# EasyEDA Pro project ProPrj_iamge v2_2026-08-18.epro, board PCB5
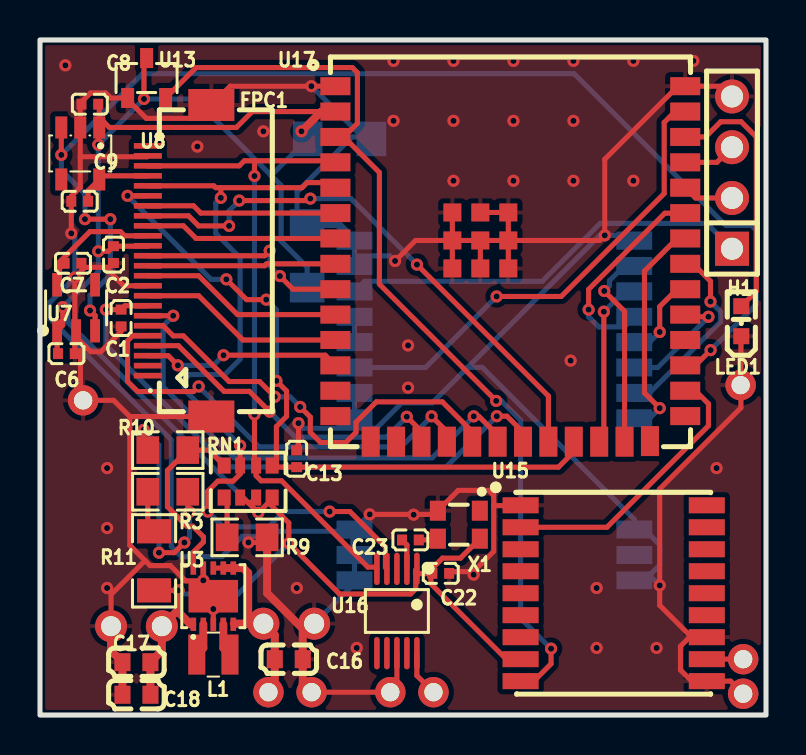
[diagram p4: board, top side]
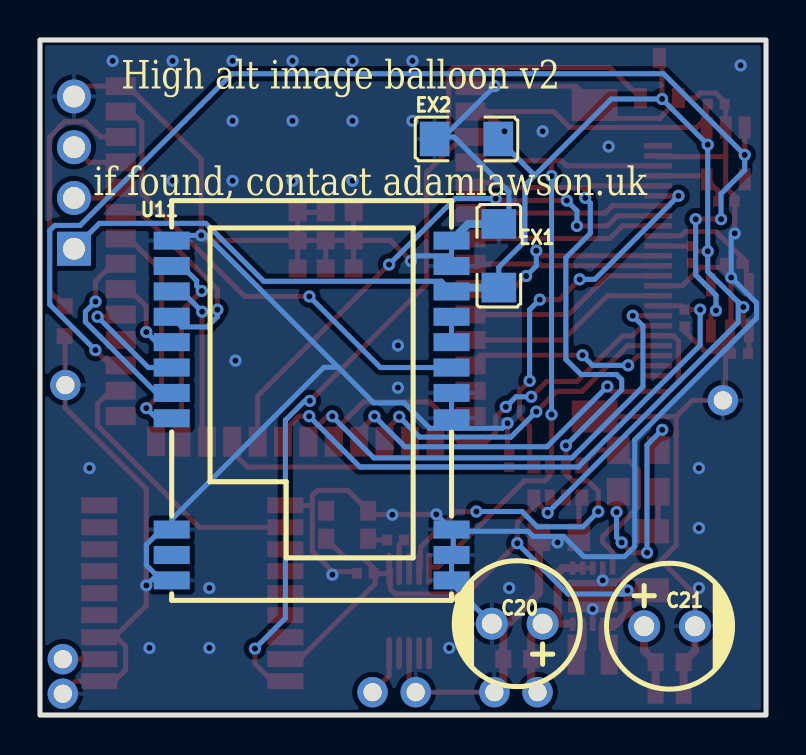
[diagram p5: board, bottom side, seen from below]

Outline 36.32 x 33.78 mm; copper layers: Top Layer, Bottom Layer. Coordinates in mm from the lower left corner of the outline.
Outline path: rectangle 0,33.78 36.32,0
Stack: Top Layer 0.035mm / Dielectric1 1.51mm FR4 er 4.5 / Bottom Layer 0.035mm

## Design rules (mm)
template: JLCPCB Capability(Two Layers Board)
spacing copperThickness1oz (default): track to track 0.102, other pairs 0.152 to 0.3
spacing copperThickness2oz: track to track 0.203, other pairs 0.152 to 0.3
track width copperThickness1oz (default): min 0.127, default 0.254, max 2.54
track width copperThickness2oz: min 0.203, default 0.254, max 2.54
differential pair differentialPair (default): width min 0.127, default 0.254, max 2.54; gap min 0.152, default 0.152
via viaSize (default): diameter min 0.5, default 0.61, max 10; hole min 0.3, default 0.305, max 6.3

## Placement (name value [footprint] x y rotation side)
C1  15pF  [C0402]  4.06 19.87 90 top
C2  100nF  [C0402]  3.68 23.04 90 top
C6  1uF  [C0402]  1.32 18.08 180 top
C7  1uF  [C0402]  1.65 22.61 180 top
C8  1uF  [C0402]  2.49 30.57 0 top
C9  1uF  [C0402]  1.99 25.71 0 top
C13  100nF  [C0402]  12.84 12.83 90 top
C16  10uF  [C0603]  12.45 2.79 180 top
C17  10uF  [C0603]  4.82 2.65 0 top
C18  10uF  [C0603]  4.83 1.02 0 top
C20  1000uF  [CAP-TH_BD6.3-P2.50-D1.0-FD]  12.45 4.57 0 bottom
C21  1000uF  [CAP-TH_BD6.3-P2.50-D1.0-FD]  4.83 4.44 180 bottom
C22  1uF  [C0402]  20.05 7.09 0 top
C23  100nF  [C0402]  18.53 8.76 180 top
EX1  EX  [C1206]  13.37 22.98 90 bottom
EX2  EX  [C1206]  14.99 28.83 180 bottom
FPC1  FH12-24S-0.5SH(55)  [FPC-SMD_FH12-24S-0.5SH-55]  6.99 22.73 270 top
H1  PZ254V-11-04P  [HDR-TH_4P-P2.54-V-M]  34.62 27.14 90 top
L1  4.7uH  [IND-SMD_L2.5-W2.0-VLS252012CX-150M]  8.67 3.03 180 top
LED1  KT-0603R  [LED-SMD_L1.6-W0.8-R-RD]  35.09 19.71 90 top
NOREF  -  [Pad_e13545]  35.05 16.51 0 top
NOREF#2  -  [Pad_e7784]  11.43 1.14 0 top
NOREF#3  -  [Pad_e7785]  13.59 1.14 0 top
NOREF#4  -  [Pad_e7783]  35.18 1.07 0 top
NOREF#5  -  [Pad_e7778]  19.69 1.14 0 top
NOREF#6  -  [Pad_e13546]  2.16 15.75 0 top
NOREF#7  -  [Pad_e7779]  17.53 1.14 0 top
NOREF#8  -  [Pad_e7782]  35.18 2.79 0 top
R3  16kΩ  [R0805]  6.39 11.17 180 top
R9  82kΩ  [R0805]  10.36 8.89 0 top
R10  470kΩ  [R0805]  6.39 13.26 180 top
R11  1kΩ  [R1206]  5.71 7.72 270 top
RN1  4.7kΩ  [RES-ARRAY-SMD_0603-8P-L3.2-W1.6-BL]  10.41 11.68 180 top
U3  RT6150AGQW  [WDFN-10_L3.0-W3.0-P0.50-BL-EP]  8.67 5.95 0 top
U7  ME6211C12M5G-N  [SOT-23-5_L3.0-W1.7-P0.95-LS2.8-BL]  1.81 20.38 0 top
U8  ME6211C28M5G-N  [SOT-23-5_L3.0-W1.7-P0.95-LS2.8-BR]  2.02 28.1 90 top
U11  E22-900M22S  [WIRELM-SMD_E22-900M22S]  22.73 15.24 180 bottom
U13  MAX809STRG-TP  [SOT-23-3_L2.9-W1.3-P1.90-LS2.4-BR]  5.33 31.88 270 top
U15  ATGM336H-5NR32  [GPS-SMD_18P-L10.1-W9.7-P1.10-TL]  28.7 6.1 0 top
U16  SI5351A-B-GTR  [MSOP-10_L3.0-W3.0-P0.50-LS5.0-BL]  17.86 5.21 180 top
U17  2.4GHz  [WIRELM-SMD_ESP32-S3-WROOM-1U]  23.53 22.57 0 top
X1  26MHz  [OSC-SMD_4P-L2.5-W2.0-BL_X1G0042110003]  20.96 9.52 180 top

## Footprints (pads in the part's own frame, mm; a bottom-side part is the same pattern mirrored in y, then rotated)
C0402
  rect 0.5x0.54 smd: 1(-0.42,0) 2(0.42,0)
C0603
  rect 0.8x0.9 smd: 1(-0.7,0) 2(0.7,0)
C1206
  rect 1.485x1.728 smd: 1(-1.593,0) 2(1.593,0)
CAP-TH_BD6.3-P2.50-D1.0-FD
  round 1.6 hole 1: 1(-1.27,0) 2(1.27,0)
FPC-SMD_FH12-24S-0.5SH-55
  rect 0.28x1.4 smd: 1(5.75,-1.588) 2(5.25,-1.588) 3(4.75,-1.588) 4(4.25,-1.588) 5(3.751,-1.588) 6(3.25,-1.588) 7(2.751,-1.588) 8(2.251,-1.588) 9(1.75,-1.588) 10(1.25,-1.588) 11(0.75,-1.588) 12(0.25,-1.588) 13(-0.25,-1.588) 14(-0.75,-1.588) 15(-1.25,-1.588) 16(-1.75,-1.588) 17(-2.25,-1.588) 18(-2.75,-1.588) 19(-3.25,-1.588) 20(-3.75,-1.588) 21(-4.25,-1.588) 22(-4.75,-1.588) 23(-5.25,-1.588) 24(-5.75,-1.588)
  rect 1.6x2.3 smd: 25(7.795,1.588) 26(-7.795,1.588)
GPS-SMD_18P-L10.1-W9.7-P1.10-TL
  rect 1.8x0.8 smd: 1(-4.657,4.4) 2(-4.657,3.3) 3(-4.657,2.2) 4(-4.657,1.1) 5(-4.657,0) 6(-4.657,-1.1) 7(-4.657,-2.2) 8(-4.657,-3.3) 9(-4.657,-4.4) 10(4.657,-4.4) 11(4.657,-3.3) 12(4.657,-2.2) 13(4.657,-1.1) 14(4.657,0) 15(4.657,1.1) 16(4.657,2.2) 17(4.657,3.3) 18(4.657,4.4)
HDR-TH_4P-P2.54-V-M
  rect 1.7x1.7 hole 1.1: 1(-3.81,0)
  round 1.7 hole 1.1: 2(-1.27,0) 3(1.27,0) 4(3.81,0)
IND-SMD_L2.5-W2.0-VLS252012CX-150M
  rect 0.85x2 smd: 1(-0.83,0) 2(0.83,0)
LED-SMD_L1.6-W0.8-R-RD
  rect 0.8x0.8 smd: 1(0.75,0) 2(-0.75,0)
MSOP-10_L3.0-W3.0-P0.50-LS5.0-BL
  oval 0.28x1.62 smd: 1(-1,-2.11) 2(-0.5,-2.11) 3(0,-2.11) 4(0.5,-2.11) 5(1,-2.11) 6(1,2.11) 7(0.5,2.11) 8(0,2.11) 9(-0.5,2.11) 10(-1,2.11)
OSC-SMD_4P-L2.5-W2.0-BL_X1G0042110003
  rect 0.8x1 smd: 1(-1.05,-0.7) 2(1.05,-0.7) 3(1.05,0.7) 4(-1.05,0.7)
Pad_e7778
  round 1.524 hole 0.914: 1(0,0)
Pad_e7779
  round 1.524 hole 0.914: 2(0,0)
Pad_e7782
  round 1.524 hole 0.914: 1(0,0)
Pad_e7783
  round 1.524 hole 0.914: 1(0,0)
Pad_e7784
  round 1.524 hole 0.914: 2(0,0)
Pad_e7785
  round 1.524 hole 0.914: 2(0,0)
Pad_e13545
  round 1.524 hole 0.914: 1(0,0)
Pad_e13546
  round 1.524 hole 0.914: 1(0,0)
R0805
  rect 1.133x1.377 smd: 1(-1,0) 2(1,0)
R1206
  rect 1.208x1.701 smd: 1(-1.479,0) 2(1.479,0)
RES-ARRAY-SMD_0603-8P-L3.2-W1.6-BL
  rect 0.65x0.8 smd: 1(-1.2,-0.8) 4(1.2,-0.8) 5(1.2,0.8) 8(-1.2,0.8)
  rect 0.5x0.8 smd: 2(-0.4,-0.8) 3(0.4,-0.8) 6(0.4,0.8) 7(-0.4,0.8)
SOT-23-3_L2.9-W1.3-P1.90-LS2.4-BR
  rect 1x0.65 smd: 1(1,-0.95) 2(1,0.95) 3(-1,0)
SOT-23-5_L3.0-W1.7-P0.95-LS2.8-BL
  rect 0.49x1.157 smd: 1(-0.95,-1.153) 2(0,-1.153) 3(0.95,-1.153)
  rect 0.49x1.175 smd: 4(0.95,1.153) 5(-0.95,1.153)
SOT-23-5_L3.0-W1.7-P0.95-LS2.8-BR
  rect 1.1x0.6 smd: 1(1.3,-0.95) 2(1.3,0) 3(1.3,0.95) 4(-1.3,0.95) 5(-1.3,-0.95)
WDFN-10_L3.0-W3.0-P0.50-BL-EP
  rect 0.28x0.665 smd: 1(-1,-1.407) 2(-0.5,-1.407) 3(0,-1.407) 4(0.5,-1.407) 5(1,-1.407) 6(1,1.407) 7(0.5,1.407) 8(0,1.407) 9(-0.5,1.407) 10(-1,1.407)
  rect 2.475x1.625 smd: 11(0,0)
WIRELM-SMD_E22-900M22S
  rect 1.8x0.9 smd: 1(7,-8.5) 2(7,-7.23) 3(7,-5.96) 4(7,-0.39) 5(7,0.88) 6(7,2.15) 7(7,3.42) 8(7,4.69) 9(7,5.96) 10(7,7.23) 11(7,8.5) 12(-7,8.5) 13(-7,7.23) 14(-7,5.96) 15(-7,4.69) 16(-7,3.42) 17(-7,2.15) 18(-7,0.88) 19(-7,-0.39) 20(-7,-5.96) 21(-7,-7.23) 22(-7,-8.5)
WIRELM-SMD_ESP32-S3-WROOM-1U
  rect 1.5x0.9 smd: 1(-8.75,8.895) 2(-8.75,7.625) 3(-8.75,6.355) 4(-8.75,5.085) 5(-8.75,3.815) 6(-8.75,2.545) 7(-8.75,1.275) 8(-8.75,0.005) 9(-8.75,-1.265) 10(-8.75,-2.535) 11(-8.75,-3.805) 12(-8.75,-5.075) 13(-8.75,-6.345) 14(-8.75,-7.615) 27(8.75,-7.615) 28(8.75,-6.345) 29(8.75,-5.075) 30(8.75,-3.805) 31(8.75,-2.535) 32(8.75,-1.265) 33(8.75,0.005) 34(8.75,1.275) 35(8.75,2.545) 36(8.75,3.815) 37(8.75,5.085) 38(8.75,6.355) 39(8.75,7.625) 40(8.75,8.895)
  rect 0.9x1.5 smd: 15(-6.985,-8.895) 16(-5.715,-8.895) 17(-4.445,-8.895) 18(-3.175,-8.895) 19(-1.905,-8.895) 20(-0.635,-8.895) 21(0.635,-8.895) 22(1.905,-8.895) 23(3.175,-8.895) 24(4.445,-8.895) 25(5.715,-8.895) 26(6.985,-8.865)
  rect 0.9x0.9 smd: 41(-2.9,2.575) 41(-2.9,1.175) 41(-2.9,-0.225) 41(-1.5,2.575) 41(-1.5,1.175) 41(-1.5,-0.225) 41(-0.1,2.575) 41(-0.1,1.175) 41(-0.1,-0.225)

## Nets
As in the schematic, except:
GND: C1.1 C2.1 C6.1 C7.1 C8.1 C9.1 C13.2 C16.1 C17.1 C18.1 C20.2 C21.2 C22.2 EX1.2 EX2.1 FPC1.10 FPC1.23 FPC1.25 FPC1.26 H1.4 LED1.2 NOREF.1 NOREF#3.2 NOREF#4.1 NOREF#6.1 NOREF#7.2 R9.2 U3.3 U3.9 U3.11 U7.2 U8.2 U11.1 U11.2 U11.3 U11.4 U11.5 U11.10 U11.11 U11.12 U11.20 U11.22 U13.1 U15.1 U15.10 U15.12 U16.8 U17.1 U17.40 U17.41 X1.2
GPSANT: NOREF#8.1 U15.11
PV: C16.2 C20.1 NOREF#2.2 U3.5 U3.6 U3.7 U3.8
SI5351A: NOREF#5.1 U16.10

Pads without a net: FPC1 1 2 24; U7 4; U8 4; U15 3 4 5 6 7 13 14 15 16 17 18; U16 3 6 7 9; U17 13 14 15 16 26 30; X1 1

## Via types
v1: diameter 0.61, hole 0.305, Top Layer to Bottom Layer, 97 vias

## Routing (per net, layer and track width the routed paths; a pad name or vN(x,y) marks a point on that pad's centre or on a via; arc(x,y) is an arc through that point)
1.2V: length 6.7
  Top Layer w0.254: 5.4,23.98 4.24,23.98 4.03,24.19 2.5,24.19 0.98,22.67 0.98,22.35 ; U7.5 0.98,21.65 0.98,22.35 ; 0.98,22.35 C7.2
2.8V: length 3.8
  Top Layer w0.254: 5.4,26.98 3.15,26.98 U8.5 2.41,26.24 C9.2
3.3V: length 128.9
  Top Layer w0.254: 11.43,10.63 11.61,10.81 RN1.8 ; 11.43,10.63 12.45,9.61 v1(12.45,8.6) 14.99,6.06 18.54,6.06 18.8,6.31 18.8,7.07 ; 11.43,10.63 v1(10.92,10.12) 10.41,10.63 ; 10.41,10.63 10.56,10.63 RN1.7 ; 10.41,10.63 10.16,10.88 RN1.6 ; 18.8,7.07 18.8,7.26 U16.1 ; 18.8,7.07 19.56,7.07 ; 19.56,7.07 19.63,7.09 19.63,7.34 20.14,7.85 21.03,7.85 22,8.83 ; 19.56,7.07 19.56,6.57 23.33,2.8 U15.8 ; v1(2.92,28.54) 2.92,29.35 U8.1 2.97,29.91 ; U13.3 5.2,32.74 v1(5.2,30.83) ; v1(2.92,23.21) 3.42,23.21 C2.2 5.38,23.46 5.4,23.48 ; 2.97,29.91 3.47,29.4 9.82,29.4 10.62,30.2 U17.2 ; 2.97,29.91 2.97,30.52 C8.2 ; 0.9,18.08 0.86,18.13 U7.1 1.14,19.51 v1(1.14,20.41) ; v1(6.93,6.24) R11.2
  Top Layer w0.4: 5.52,1.02 C17.2 6.1,3.22 C21.1 6.87,5.22 6.93,5.22 ; 6.93,5.22 6.93,5.14 7.53,4.54 7.61,4.54 ; 6.93,5.22 v1(6.93,6.24) ; v1(13.08,29.21) 14.07,30.2
  Bottom Layer w0.254: 1.39,20.67 2.92,22.19 v1(2.92,23.21) v1(2.92,28.54) v1(5.2,30.83) 7.74,30.83 11.55,27.02 ; 1.39,20.67 1.39,19.65 v1(10.92,10.12) ; 1.39,20.67 v1(1.14,20.41) ; EX2.2 11.58,27.02 11.55,27.02 ; v1(12.45,8.6) 9.91,6.06 7.11,6.06 v1(6.93,6.24) ; EX1.1 13.37,22.41 12.06,23.72 12.06,26.51 11.55,27.02 ; U11.9 16.24,21.71 25.13,21.71 28.03,24.6 33.35,24.6 H1.1
  Bottom Layer w0.4: EX1.1 15.54,21.39 U11.9
GND: length 245.9
  Top Layer w0.254: 2.28,18.43 2.53,18.18 3.04,18.18 4.06,19.19 C1.1 ; 2.28,18.43 2.03,18.18 ; 2.28,18.43 1.81,18.91 U7.2 ; U17.41 U17.41 ; U17.41 18.79,23.75 v1(17.76,22.72) ; U17.41 U17.41 ; U17.41 U17.41 ; U17.41 U17.41 ; U17.41 U17.41 ; C22.2 20.56,7.18 21.68,7.18 22.7,8.19 22.7,10.48 ; U15.12 33.31,3.95 32.55,3.95 ; 4.49,14.94 FPC1.25 ; 4.49,14.94 3.68,15.75 NOREF#6.1 2.03,15.88 2.03,18.18 ; 4.49,14.94 4.49,8.49 5.26,7.73 ; U15.1 24.03,10.48 22.7,10.48 ; 3.27,22.4 3.46,22.4 C2.1 ; 3.27,22.4 4.19,21.48 5.4,21.48 ; 3.27,22.4 2.25,22.4 ; 32.55,3.95 32.04,3.44 32.04,2.25 32.6,1.7 U15.10 34.55,1.7 NOREF#4.1 ; 32.55,3.95 31,5.49 v1(31,6.49) 31,11.31 35.07,15.38 35.07,16.49 ; v1(10.43,8.64) 11.11,8.64 R9.2 ; LED1.2 35.07,18.94 35.07,16.49 ; 2.03,18.18 1.84,18.18 C6.1 v1(1.74,21.89) 2.25,22.4 ; U17.41 U17.41 ; U17.41 28,23.75 v1(28.26,24) 28.26,27.81 31.81,31.37 32.18,31.37 U17.40 34.11,31.47 H1.4 ; U17.41 U17.41 U17.41 ; 35.07,16.49 NOREF.1 ; 5.4,27.98 5.35,27.94 2.02,27.94 ; 2.25,22.4 C7.1 ; v1(1.57,24.1) C9.1 1.57,25.96 2.02,26.41 2.02,27.94 ; 2.02,30.51 2.02,30.62 2.52,31.13 3.29,31.13 3.54,30.88 4.3,30.88 ; 2.02,30.51 C8.1 ; 2.02,30.51 U8.2 2.02,27.94 ; 5.26,7.73 3.56,6.03 C21.2 ; 5.26,7.73 5.51,7.48 6.53,7.48 7.29,6.72 8.05,6.72 8.05,6.57 U3.11 v1(8.67,5.31) U3.3 ; 4.3,30.88 5.32,29.86 7.91,29.86 FPC1.26 9.51,31.47 v1(13.58,31.47) U17.1 ; 4.3,30.88 U13.1 ; 22.7,10.48 22.7,10.99 22.44,11.24 20.92,11.24 X1.2 19.72,10.04 v1(16.5,10.04) ; U16.8 17.86,1.47 NOREF#7.2 NOREF#3.2 ; v1(8.17,6.74) U3.9 ; v1(12.93,14.6) 12.93,13.33 C13.2
  Top Layer w0.4: NOREF#3.2 13.15,1.59 C16.1 ; 13.14,2.8 13.14,4.32 11.36,6.1 R9.2 ; C21.2 3.56,3.21 C17.1 4.12,1.02
  Bottom Layer w0.254: U11.22 30.24,6.74 30.5,6.99 ; v1(13.58,31.47) 16.12,28.93 ; 16.12,28.93 16.48,28.93 EX2.1 ; 16.12,28.93 15.61,28.93 12.86,26.18 12.86,25.08 EX1.2 ; 21.4,17.4 28,24 v1(28.26,24) 29.47,24 U11.12 ; 21.4,17.4 22.12,17.4 29.73,9.79 U11.20 30.24,9.28 31,8.52 31,7.5 30.5,6.99 ; 21.4,17.4 19.62,15.62 18.1,15.62 16.83,14.35 15.81,14.35 ; 15.73,22.98 U11.10 ; 15.73,22.98 U11.11 ; 15.73,22.98 17.51,22.98 v1(17.76,22.72) ; 30.5,6.99 v1(31,6.49) ; 15.81,14.35 15.81,14.77 U11.4 U11.5 ; 15.81,14.35 13.19,14.35 v1(12.93,14.6) ; 15.65,9.19 15.65,8.09 U11.2 U11.1 15.73,6.59 C20.2 ; 15.65,9.19 11.9,9.19 11.65,8.94 10.12,8.94 ; 15.65,9.19 U11.3 v1(16.5,10.04) ; v1(1.57,24.1) 1.74,23.93 v1(1.74,21.89) 0.47,20.62 0.47,19.86 6.57,13.77 6.57,8.43 7.08,7.92 9.11,7.92 10.12,8.94 ; 10.12,8.94 v1(10.43,8.64)
  Bottom Layer w0.4: EX1.2 14.9,24.58 U11.11
  vias: v1(1.27,32.51) v1(3.36,12.36) v1(3.36,9.36) v1(3.36,6.36) v1(7.87,28.45) v1(11.18,29.21) v1(12.85,6.36) v1(15.85,3.36) v1(17.69,32.74) v1(17.69,29.74) v1(18.41,18.49) v1(18.41,16.38) v1(18.69,10.02) v1(20.69,32.74) v1(20.69,29.74) v1(20.69,26.74) v1(21.69,7.02) v1(23.69,32.74) v1(23.69,29.74) v1(23.69,26.74) v1(26.55,17.74) v1(26.69,32.74) v1(26.69,29.74) v1(26.69,26.74) v1(27.85,6.36) v1(27.85,3.36) v1(29.69,32.74) v1(29.69,26.74) v1(30.85,3.36) v1(32.69,32.74) v1(33.85,12.36)
BUSY: length 8.5
  Top Layer w0.254: U17.24 28.21,13.91 v1(28.21,20.18)
  Bottom Layer w0.254: v1(28.21,20.18) 29.22,21.2 U11.14
CAMPWR: length 60.7
  Top Layer w0.254: U7.3 2.76,19.99 v1(2.5,20.24) ; v1(3.52,24.81) v1(2.25,24.81) ; v1(1.07,28.03) U8.3 ; v1(33.55,18.26) 32.79,17.5 U17.29
  Bottom Layer w0.254: v1(33.55,18.26) 35.84,20.55 35.84,24.25 35.58,24.5 34.31,24.5 26.72,32.09 5.13,32.09 v1(1.07,28.03) 1.07,27.27 2.25,26.08 v1(2.25,24.81) ; v1(2.5,20.24) 2.5,21 3.52,22.02 v1(3.52,24.81)
CAMRST: length 35.1
  Top Layer w0.254: 11.83,12.41 11.83,14.44 12.34,14.95 12.34,16.22 v1(11.83,16.72) ; 11.83,12.41 C13.1 25.94,12.41 26.7,13.17 U17.23 ; 11.83,12.41 11.69,12.41 RN1.1 ; v1(9.32,21.8) 10.34,20.79 v1(11.32,20.79) ; v1(4.38,25.98) 5.4,25.98
  Bottom Layer w0.254: v1(9.32,21.8) 8.56,21.8 v1(4.38,25.98) ; v1(11.32,20.79) 11.83,20.28 v1(11.83,16.72)
CSID0: length 21.4
  Top Layer w0.254: v1(13.02,15.42) 13.53,14.91 13.53,14.15 14.03,13.64 15.3,13.64 15.81,14.15 15.81,14.66 16.83,15.67 20.13,15.67 21.62,14.18 U17.19 ; 5.4,19.48 6.16,19.48 6.67,18.97 7.18,18.97 9.46,16.69 10.99,16.69 v1(11.75,15.93)
  Bottom Layer w0.254: v1(13.02,15.42) 12.51,15.93 v1(11.75,15.93)
CSID1: length 16.8
  Top Layer w0.254: v1(11.49,15.18) 10.48,16.2 9.21,16.2 6.92,18.48 5.4,18.48 ; U17.17 19.09,14.19 v1(18.35,14.93)
  Bottom Layer w0.254: v1(11.49,15.18) 12.76,13.91 17.34,13.91 v1(18.35,14.93)
CSID2: length 10
  Top Layer w0.254: v1(6.9,17.5) 6.41,17.98 5.4,17.98 ; v1(9.18,18.01) 14.27,18.01 U17.12
  Bottom Layer w0.254: v1(6.9,17.5) 8.68,17.5 v1(9.18,18.01)
CSID3: length 22.1
  Top Layer w0.254: v1(7.94,16.44) 7.68,16.19 4.89,16.19 4.38,16.7 4.38,18.73 4.63,18.98 5.4,18.98 ; U17.18 20.35,14.18 v1(19.59,14.95)
  Bottom Layer w0.254: v1(7.94,16.44) 10.95,13.42 18.07,13.42 v1(19.59,14.95)
CSID4: length 24.8
  Top Layer w0.254: 5.4,19.98 v1(6.67,19.98) ; v1(21.7,14.95) 21.95,14.95 22.9,14.01 U17.20
  Bottom Layer w0.254: v1(21.7,14.95) 19.62,12.87 9.72,12.87 6.16,16.43 6.16,19.47 v1(6.67,19.98)
CSID5: length 10.3
  Top Layer w0.254: U17.11 10.15,18.77 7.94,20.98 5.4,20.98
CSID6: length 10.2
  Top Layer w0.254: 5.4,21.98 7.94,21.98 9.88,20.04 U17.10
CSID7: length 10.7
  Top Layer w0.254: 5.4,22.98 11.24,22.98 v1(11.49,23.24) ; U17.9 12.66,21.31 v1(12,21.97)
  Bottom Layer w0.254: v1(11.49,23.24) 11.49,22.47 v1(12,21.97)
CSIHSYNC: length 9.6
  Top Layer w0.254: 5.4,24.48 7.18,24.48 7.81,23.85 U17.7
CSIPCLK: length 29.2
  Top Layer w0.254: U17.21 24.12,13.72 24.12,14.19 23.36,14.95 v1(22.85,14.95) ; 5.4,20.48 4.25,20.48 C1.2 v1(3.3,20.29)
  Bottom Layer w0.254: v1(22.85,14.95) 20.31,12.41 9.39,12.41 3.3,18.51 v1(3.3,20.29)
CSIVSYNC: length 9.5
  Top Layer w0.254: 5.4,25.48 7.68,25.48 8.05,25.12 U17.6
CSIXCLK: length 9.4
  Top Layer w0.254: U17.8 11.34,22.58 11.24,22.48 5.4,22.48
DIO1: length 10.1
  Top Layer w0.254: v1(28.23,21.22) 29.25,20.2 U17.25
  Bottom Layer w0.254: U11.13 29.22,22.47 28.48,21.73 28.48,21.47 v1(28.23,21.22)
EN: length 46.9
  Top Layer w0.254: U13.2 7.81,32.4 15.63,32.4 15.88,32.15 15.88,29.61 15.2,28.93 ; 15.2,28.93 U17.3 ; 15.2,28.93 16.98,27.15 16.98,21.56 v1(22.82,15.72) ; v1(25.57,3.32) 25.57,2.56 24.81,1.8 24.15,1.8 U15.9
  Bottom Layer w0.254: v1(22.82,15.72) 23.08,15.72 24.04,14.75 24.04,4.85 v1(25.57,3.32)
GPSANT: length 1.8
  Top Layer w0.254: U15.11 35.18,2.8
GPSTX: length 14
  Top Layer w0.254: U15.2 28.36,9.4 33.44,14.48 33.44,15.58 32.79,16.23 U17.28
MISO: length 4.4
  Top Layer w0.254: v1(31,19.17) 31,20.44 31.76,21.2 32.17,21.2 U17.32
  Bottom Layer w0.254: U11.16 30.5,18.66 v1(31,19.17)
MOSI: length 6
  Top Layer w0.254: v1(33.44,19.93) 32.39,19.93 U17.31
  Bottom Layer w0.254: v1(33.44,19.93) 30.9,17.39 U11.17
NRST: length 10.5
  Top Layer w0.254: v1(27.45,20.29) 27.45,21.3 31.26,25.11 32.27,25.11 U17.35
  Bottom Layer w0.254: v1(27.45,20.29) 27.45,19.93 27.96,19.42 29.22,19.42 U11.15
NSS: length 11.4
  Top Layer w0.254: v1(31,15.36) 30.24,16.12 30.24,22.22 31.87,23.85 U17.34
  Bottom Layer w0.254: U11.19 30.5,14.85 v1(31,15.36)
PV: length 9.7
  Top Layer w0.254: U3.7 U3.8 ; C20.1 10.41,4.57
  Top Layer w0.4: U3.7 U3.6 10.17,7.35 10.41,7.11 10.41,4.57 9.7,4.57 ; NOREF#2.2 11.75,1.46 C16.2 11.75,4 C20.1
PWRD: length 27.6
  Top Layer w0.254: 5.4,24.98 7.43,24.98 7.94,24.47 v1(9.46,24.47) ; v1(18.86,22.54) 25.44,15.97 U17.22 ; v1(13.53,25.84) 13.43,25.74 v1(9.97,25.74)
  Bottom Layer w0.254: v1(9.97,25.74) 9.46,25.24 v1(9.46,24.47) ; v1(18.86,22.54) 15.56,25.84 v1(13.53,25.84)
RXEN: length 23.9
  Top Layer w0.254: U17.39 32.24,30.16 31.74,30.16 31.23,29.65 31.23,26.1 26.07,20.95 v1(22.84,20.95)
  Bottom Layer w0.254: U11.6 19.29,17.39 v1(22.84,20.95)
SCK: length 9.7
  Top Layer w0.254: U17.33 32.39,22.47 32.78,22.47 33.54,21.71 v1(33.54,20.69)
  Bottom Layer w0.254: v1(33.54,20.69) 34.05,20.18 34.05,19.68 30.5,16.12 U11.18
SI5351A: length 2.3
  Top Layer w0.254: U16.10 18.86,1.97 NOREF#5.1
TWISCK: length 42.3
  Top Layer w0.254: v1(10.01,13.48) RN1.3 10.01,12.06 9.66,11.71 8.9,11.71 8.39,11.2 v1(8.39,10.18) ; U17.5 14.53,26.64 13.37,26.64 13.11,26.39 9.05,26.39 ; U16.4 17.28,7.39 17.28,8.4 15.5,10.18 v1(14.49,10.18) ; 9.05,26.39 v1(9.05,25.88) ; 9.05,26.39 8.79,26.39 8.7,26.48 5.4,26.48
  Bottom Layer w0.254: v1(9.05,25.88) 8.79,25.63 8.79,24.1 10.01,22.88 10.01,17.8 9.25,17.04 7.47,17.04 7.22,16.79 7.22,16.28 v1(10.01,13.48) ; v1(8.39,10.18) 9.16,9.42 11.44,9.42 12.2,10.18 v1(14.49,10.18)
TWISDA: length 33.3
  Top Layer w0.254: U17.4 14.7,27.74 10.73,27.74 ; 5.4,27.48 9.97,27.48 10.22,27.74 10.73,27.74 ; 10.73,27.74 v1(10.73,26.97) ; U16.5 16.77,7.4 16.4,7.4 12.08,11.72 11.07,11.72 10.81,11.98 RN1.2 10.73,12.57 v1(10.73,15.04)
  Bottom Layer w0.254: v1(10.73,26.97) v1(10.73,15.04)
U0RXD: length 2.6
  Top Layer w0.254: U17.36 32.79,25.87 H1.2
U0TXD: length 2.7
  Top Layer w0.254: H1.3 33.87,27.66 U17.37
$1N1655: length 9.6
  Top Layer w0.254: RN1.4 8.44,13.26 R10.1 6.38,12.24 6.38,10.42 7.35,9.45 7.65,9.45 8.18,8.92 8.18,8.66 7.67,8.15 U3.10
$1N1673: length 1.7
  Top Layer w0.4: U3.4 9.17,3.36 L1.1
$1N1675: length 1.6
  Top Layer w0.4: L1.2 8.17,3.35 U3.2
$1N1697: length 2.1
  Top Layer w0.254: R9.1 9.36,10.74 RN1.5
$1N1698: length 11.7
  Top Layer w0.254: v1(7.22,8.63) 6.72,8.12 v1(5.95,8.12) ; v1(7.48,10.16) 7.39,10.24 R3.1 ; R10.2 5.19,13.46 v1(5.19,14.27)
  Bottom Layer w0.254: v1(7.22,8.63) 7.48,8.89 v1(7.48,10.16) ; v1(5.19,14.27) 5.95,13.51 v1(5.95,8.12)
$1N1700: length 2.1
  Top Layer w0.254: R11.1 5.39,9.51 R3.2
$1N1735: length 1.5
  Top Layer w0.254: C23.2 18.36,8.52 U16.2
$1N1737: length 1
  Top Layer w0.254: 19.91,8.83 19.84,8.76 C23.1
$1N3081: length 1.3
  Bottom Layer w0.254: U11.7 U11.8
$1N4098: length 13
  Top Layer w0.254: U17.38 33.3,28.93 34.06,29.69 35.07,29.69 35.84,28.93 35.84,21.21 LED1.1

## Copper pours and planes (outline as drawn; the poured copper is in the pictures)
GND on Top Layer: -1.02,35.05 37.97,35.05 37.97,-1.4 -1.02,-1.4
GND on Bottom Layer: -3.05,36.83 39.5,36.83 39.5,-2.79 -3.05,-2.79

## Text on the board
Bottom Silkscreen Layer: High alt image balloon v2 | if found, contact adamlawson.uk
